# EAGLE design PCB1-SP (EAGLE 9.6.2)
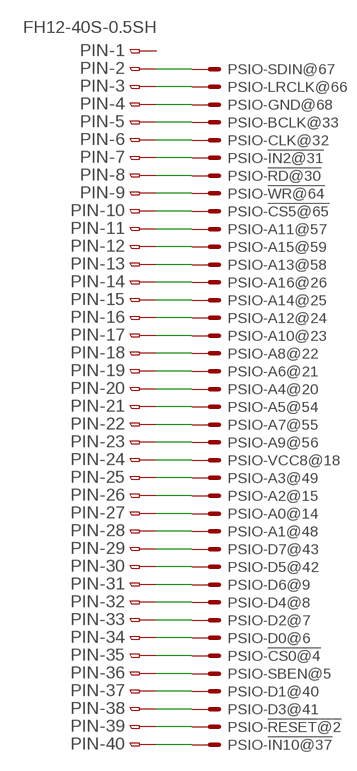
[diagram p0: schematic, sheet 1]

## Parts
PIN  FH12-40S-0.5SH  [FH12-40S-0.5SH]
PSIO  PIOCONNPIOCONN-S  [PIOCONN]

## Nets
N$1: PIN.40 PSIO.37
N$2: PIN.39 PSIO.2
N$3: PIN.38 PSIO.41
N$4: PIN.37 PSIO.40
N$5: PIN.36 PSIO.5
N$6: PIN.35 PSIO.4
N$7: PIN.34 PSIO.6
N$8: PIN.33 PSIO.7
N$9: PIN.32 PSIO.8
N$10: PIN.31 PSIO.9
N$11: PIN.30 PSIO.42
N$12: PIN.29 PSIO.43
N$13: PIN.28 PSIO.48
N$14: PIN.27 PSIO.14
N$15: PIN.26 PSIO.15
N$16: PIN.25 PSIO.49
N$17: PIN.24 PSIO.18
N$18: PIN.2 PSIO.67
N$19: PIN.3 PSIO.66
N$20: PIN.4 PSIO.68
N$21: PIN.5 PSIO.33
N$22: PIN.6 PSIO.32
N$23: PIN.7 PSIO.31
N$24: PIN.8 PSIO.30
N$25: PIN.9 PSIO.64
N$26: PIN.10 PSIO.65
N$27: PIN.23 PSIO.56
N$28: PIN.11 PSIO.57
N$29: PIN.22 PSIO.55
N$30: PIN.21 PSIO.54
N$31: PIN.12 PSIO.59
N$32: PIN.13 PSIO.58
N$33: PIN.20 PSIO.20
N$34: PIN.14 PSIO.26
N$35: PIN.19 PSIO.21
N$36: PIN.15 PSIO.25
N$37: PIN.16 PSIO.24
N$38: PIN.17 PSIO.23
N$39: PIN.18 PSIO.22
Unconnected: PIN.1

## Library data of the parts
PIN = con-hirose:FH12-40S-0.5S: 0.5mm Pitch Connectors For FPC/FFC Source: Data sheet <http://www.hirose.co.jp/cataloge_hp/e58605370.pdf>; MPN: FH12-40S-0.5SH(55); OC_FARNELL: 1324556; OC_NEWARK: 34M6178
PSIO = pixel:PIOCONN: CONNECTOR 68-pin 1.27mm (.050 inch) pitch SCSI+ unshielded receptacle right angle all plastic

## Board
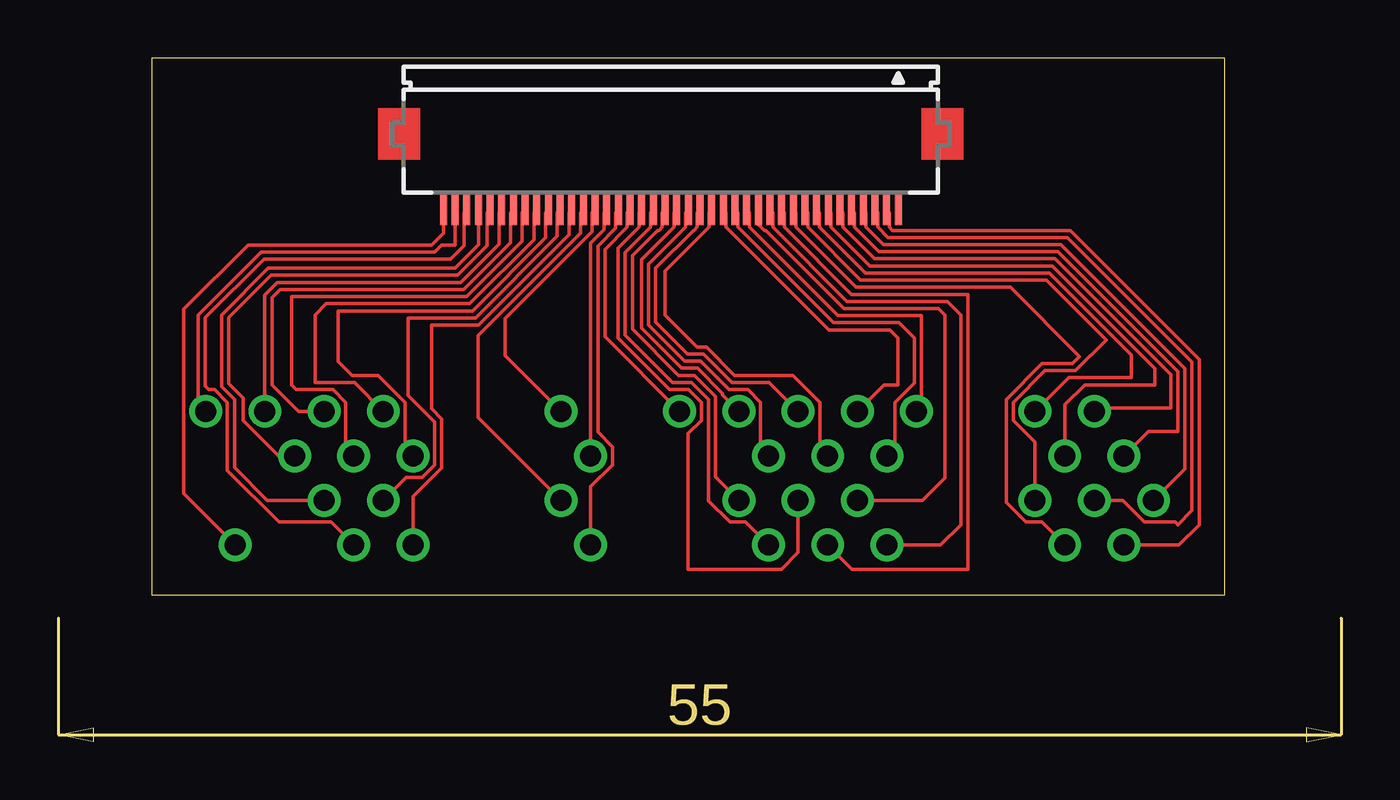
[diagram p1: board, top side]

Size 46 x 23 mm. Coordinates in mm from the lower left corner, seen from the top.
Outline: 0,0 46,0 46,23 0,23 0,0
Copper layers (1*16): Top 0.035mm / dielectric 1.5mm / Bottom 0.035mm
Design rules "default": minimum track width 6mil, minimum drill 0.35mm, track to track 6mil, track to pad 6mil, pad to pad 6mil, via to via 6mil, smd to smd 6mil, copper to edge 40mil, drill to drill 6mil, minimum pad ring 10mil, minimum via ring 8mil, stop-mask expansion 4mil, vias tented up to drill 0mil, thermal gap 10mil

### Footprints (pad centres in the part's own frame; a part is rotated, then mirrored left to right if it is on the bottom)
FH12-40S-0.5SH = smd 0.3 x 1.3: 1 -9.75,3.25; 2 -9.25,3.25; 3 -8.75,3.25; 4 -8.25,3.25; 5 -7.75,3.25; 6 -7.25,3.25; 7 -6.75,3.25; 8 -6.25,3.25; 9 -5.75,3.25; 10 -5.25,3.25; 11 -4.75,3.25; 12 -4.25,3.25; 13 -3.75,3.25; 14 -3.25,3.25; 15 -2.75,3.25; 16 -2.25,3.25; 17 -1.75,3.25; 18 -1.25,3.25; 19 -0.75,3.25; 20 -0.25,3.25; 21 0.25,3.25; 22 0.75,3.25; 23 1.25,3.25; 24 1.75,3.25; 25 2.25,3.25; 26 2.75,3.25; 27 3.25,3.25; 28 3.75,3.25; 29 4.25,3.25; 30 4.75,3.25; 31 5.25,3.25; 32 5.75,3.25; 33 6.25,3.25; 34 6.75,3.25; 35 7.25,3.25; 36 7.75,3.25; 37 8.25,3.25; 38 8.75,3.25; 39 9.25,3.25; 40 9.75,3.25
PIOCONN = drill 0.9 pad 1.27: 2 19.685,2.863; 4 17.145,2.863; 5 15.875,0.953; 6 14.605,2.863; 7 13.335,0.953; 8 12.065,2.863; 9 10.795,0.953; 14 4.445,2.863; 15 3.175,0.953; 18 -0.635,2.863; 20 -3.175,2.863; 21 -4.445,0.953; 22 -5.715,2.863; 23 -6.985,0.953; 24 -8.255,2.863; 25 -9.525,0.953; 26 -10.795,2.863; 30 -15.875,2.863; 31 -17.145,0.953; 32 -18.415,2.863; 33 -19.685,0.953; 37 18.415,-2.867; 40 14.605,-0.957; 41 13.335,-2.867; 42 12.065,-0.957; 43 10.795,-2.867; 48 4.445,-0.957; 49 3.175,-2.867; 54 -3.175,-0.957; 55 -4.445,-2.867; 56 -5.715,-0.957; 57 -6.985,-2.867; 58 -8.255,-0.957; 59 -9.525,-2.867; 64 -15.875,-0.957; 65 -17.145,-2.867; 66 -18.415,-0.957; 67 -19.685,-2.867; 68 -20.955,-0.957

### Placement (x,y rotation side)
PIN  22.26,19.75 180 top
PSIO  22,5 0 bottom

### Tracks (layer width: path | path; a pad name or v marks a point on that pad's centre or on a via)
N$1
  Top 0.152: PSIO.37 1.38,4.34 1.38,12.25 4.13,15 12,15 12.51,15.51 PIN.40
N$2
  Top 0.152: PSIO.2 2,8.18 2,12 4.7,14.7 12.13,14.7 12.43,15 13,15 13.01,15.01 PIN.39
N$3
  Top 0.152: PSIO.41 7.69,3.11 5.46,3.11 3.25,5.32 3.25,8.25 2.7,8.8 2.45,8.8 2.3,8.94 2.3,11.87 4.82,14.39 12.82,14.39 13.39,14.96 13.39,16.38 PIN.38
N$4
  Top 0.152: PSIO.40 4.96,4.04 3.55,5.45 3.55,8.38 3,8.93 3,12 5,14 13,14 14.01,15.01 PIN.37
N$5
  Top 0.152: PSIO.5 5.45,5.95 3.92,7.48 3.92,8.44 3.3,9.05 3.3,11.87 5.13,13.7 13.13,13.7 14.39,14.96 14.39,16.38 PIN.36
N$6
  Top 0.152: PSIO.4 4.86,12.86 5.39,13.39 13.25,13.39 14.89,15.03 14.89,16.38 PIN.35
N$7
  Top 0.152: PSIO.6 6.3,7.86 5.16,9 5.16,12.73 5.52,13.09 13.38,13.09 15.39,15.1 15.39,16.38 PIN.34
N$8
  Top 0.152: PSIO.7 8.33,6.29 8.33,8.25 7.78,8.8 6.2,8.8 6,9 6,12.78 13.5,12.78 15.89,15.16 15.89,16.38 PIN.33
N$9
  Top 0.152: PSIO.8 8.7,9.1 7,9.1 7,12 7.48,12.48 13.63,12.48 16.39,15.23 16.39,16.38 PIN.32
N$10
  Top 0.152: PSIO.9 10.87,6.29 10.87,8.25 9.71,9.4 8.6,9.4 8,10 8,12.17 13.76,12.17 16.89,15.3 16.89,16.38 PIN.31
N$11
  Top 0.152: PSIO.42 10.91,5.02 11.59,5.02 12.14,5.57 12.14,7.41 11,8.55 11,11.87 13.88,11.87 17.39,15.37 17.39,16.38 PIN.30
N$12
  Top 0.152: PSIO.43 11.21,4.2 12.44,5.44 12.44,7.54 12,7.98 12,11.56 14.01,11.56 17.89,15.44 17.89,16.38 PIN.29
N$13
  Top 0.152: PSIO.48 14,7.6 14,11.12 18.39,15.51 18.39,16.38 PIN.28
N$14
  Top 0.152: PSIO.14 15.16,10.26 15.16,11.85 18.89,15.58 18.89,16.38 PIN.27
N$15
  Top 0.152: PSIO.15 18.82,15.08 19.39,15.65 19.39,16.38 PIN.26
N$16
  Top 0.152: PSIO.49 18.82,4.63 19.76,5.57 19.76,6.34 19.13,6.97 19.13,14.96 19.89,15.72 19.89,16.38 PIN.25
N$17
  Top 0.152: PSIO.18 19.43,11.06 19.43,14.8 20.39,15.76 20.39,16.38 PIN.24
N$18
  Top 0.152: PSIO.67 44.04,2.13 44.91,3 44.91,10.09 39.38,15.62 31.77,15.62 31.63,15.76 31.63,16.38 PIN.2
N$19
  Top 0.152: PSIO.66 41.64,4.04 42.57,3.11 43.89,3.11 44,3 44.6,3.6 44.6,9.97 39.25,15.32 31.57,15.32 31.13,15.76 31.13,16.38 PIN.3
N$20
  Top 0.152: PSIO.68 44.3,5.39 44.3,9.7 38.99,15.01 31.38,15.01 30.63,15.76 30.63,16.38 PIN.4
N$21
  Top 0.152: PSIO.33 42.73,7 43.99,7 43.99,9.58 38.86,14.71 31.18,14.71 30.13,15.76 30.13,16.38 PIN.5
N$22
  Top 0.152: PSIO.32 40.55,8 43.69,8 43.69,9.45 38.74,14.4 30.98,14.4 29.63,15.76 29.63,16.38 PIN.6
N$23
  Top 0.152: PSIO.31 39.15,8.14 40,9 43,9 43,9.71 38.61,14.1 30.79,14.1 29.13,15.76 29.13,16.38 PIN.7
N$24
  Top 0.152: PSIO.30 39.32,9.3 42,9.3 42,10.28 38.48,13.79 30.59,13.79 28.63,15.76 28.63,16.38 PIN.8
N$25
  Top 0.152: PSIO.64 37.88,6.54 36.94,7.48 36.94,8.25 38.3,9.61 39.61,9.61 40.92,10.92 38.36,13.49 30.4,13.49 28.13,15.76 28.13,16.38 PIN.9
N$26
  Top 0.152: PSIO.65 38.17,3.11 37.49,3.11 36.64,3.96 36.64,8.38 38.18,9.91 39.48,9.91 39.78,10.22 36.82,13.18 30.2,13.18 27.63,15.76 27.63,16.38 PIN.10
N$27
  Top 0.152: PSIO.56 27.71,1.81 27,1.09 23,1.09 23,6.91 23.57,7.48 23.57,8.25 23.02,8.8 22.2,8.8 20,11 20,14.87 20.89,15.76 20.89,16.38 PIN.23
N$28
  Top 0.152: PSIO.57 30.03,1.09 35,1.09 35,12.88 30.01,12.88 27.13,15.76 27.13,16.38 PIN.11
N$29
  Top 0.152: PSIO.55 25.47,3.11 24.79,3.11 23.87,4.03 23.87,8.38 23.15,9.1 22.33,9.1 20.3,11.13 20.3,14.67 21.39,15.76 21.39,16.38 PIN.22
N$30
  Top 0.152: PSIO.54 24.18,5.04 24.18,8.5 23.27,9.4 22.59,9.4 20.61,11.39 20.61,14.54 21.69,15.62 21.75,15.62 21.89,15.76 21.89,16.38 PIN.21
N$31
  Top 0.152: PSIO.59 33.83,2.13 34.7,3 34.7,12 34.12,12.57 29.81,12.57 26.63,15.76 26.63,16.38 PIN.12
N$32
  Top 0.152: PSIO.58 33.04,4.04 34,5 34,12 33.73,12.27 29.69,12.27 26.33,15.62 26.27,15.62 26.01,15.88 PIN.13
N$33
  Top 0.152: PSIO.20 24.48,8.56 24.48,8.63 23.4,9.71 22.72,9.71 21,11.43 21,14.37 22.39,15.76 22.39,16.38 PIN.20
N$34
  Top 0.152: PSIO.26 33,8.07 33,11.96 29.42,11.96 25.63,15.76 25.63,16.38 PIN.14
N$35
  Top 0.152: PSIO.21 26.11,6.29 26.11,8.25 25.56,8.8 24.75,8.8 23.53,10.02 22.85,10.02 21.3,11.56 21.3,14.17 22.89,15.76 22.89,16.38 PIN.19
N$36
  Top 0.152: PSIO.25 31.86,6.29 31.86,8.25 32.7,9.08 32.7,11 32.04,11.66 29.23,11.66 25.13,15.76 25.13,16.38 PIN.15
N$37
  Top 0.152: PSIO.24 31.39,9 32,9 32,11 31.65,11.35 29.03,11.35 24.63,15.76 24.63,16.38 PIN.16
N$38
  Top 0.152: PSIO.23 28.65,6.29 28.65,8.25 27.49,9.4 25,9.4 23.78,10.62 23.38,10.62 22,12 22,13.87 23.89,15.76 23.89,16.38 PIN.17
N$39
  Top 0.152: PSIO.22 26.48,9.1 24.87,9.1 23.65,10.32 22.97,10.32 21.61,11.68 21.61,14 23.23,15.62 23.25,15.62 23.39,15.76 23.39,16.38 PIN.18